# Altium schematic sheet AVCC.SchDoc
size A4
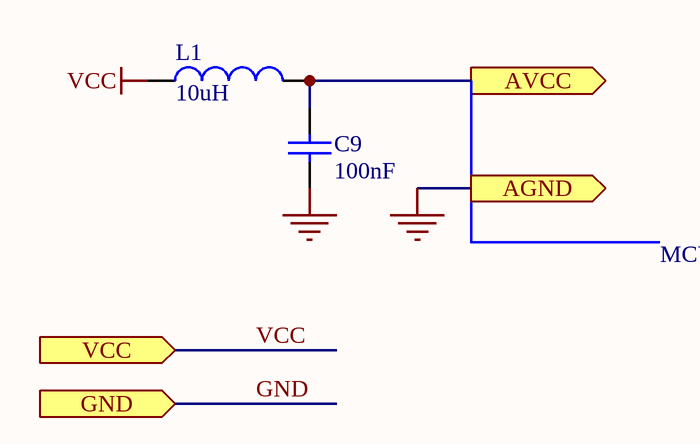
[diagram p0: AVCC.SchDoc]

## Parts
C9  value 100nF  [RAD_2.54mm]  (hidden comment: Capacitor_2)
L1  value 10uH  [Inductor_Axial]  (hidden comment: Inductor)

## Ports
AGND (out), AVCC (out), GND (in), VCC (in)

## Nets
GND: C9.1 ; port GND, port AGND
VCC: L1.1 ; port VCC
AVCC: C9.2 L1.2 ; port AVCC

## Notes on the sheet
- MCU

## Library data of the parts
C9 = Capacitor_2: Capacitor; Manufacturer: Generic Components; Class I: Passive; Published: 8-Jun-2000; Revision: July-2002: Re-released for DXP Platform.; Publisher: Altium Limited; Class II: Capacitor
L1 = Inductor: Manufacturer: Generic Components; Class I: Passive; Published: 8-Jun-2000; Revision: July-2002: Re-released for DXP Platform.; Publisher: Altium Limited; Class II: Inductor